# EAGLE design nixie_test_v3 (EAGLE 6.2)
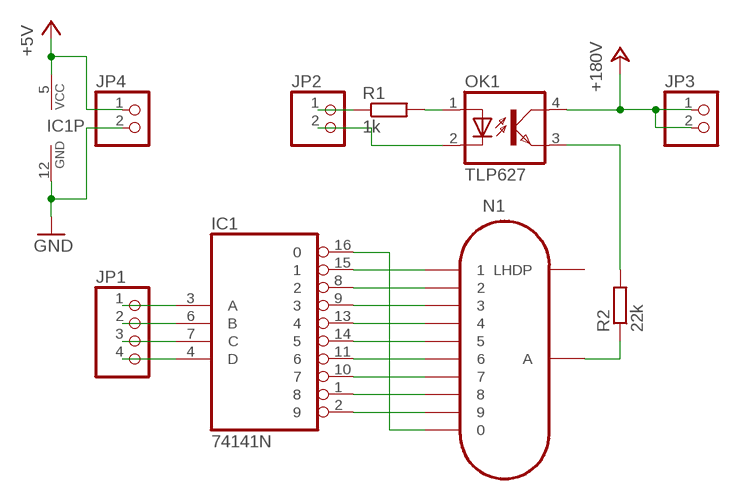
[diagram p0: schematic, sheet 1]

## Parts
IC1  74141N  [DIL16]
JP1  PINHD-1X4  [1X04]
JP2  PINHD-1X2  [1X02]
JP3  PINHD-1X2  [1X02]
JP4  PINHD-1X2  [1X02]
N1  IN-12B  [IN-12]
OK1  TLP627  [4-SMD]
R1  1k  R-EU_R0805  [R0805]
R2  22k  R-EU_10  [0207/10]

## Nets
+5V: IC1.5(VCC) JP4.1
+180V: JP3.1 JP3.2 OK1.4(COL)
A: IC1.3(A) JP1.1
B: IC1.6(B) JP1.2
C: IC1.7(C) JP1.3
C0: IC1.16 N1.0
C1: IC1.15 N1.1
C2: IC1.8 N1.2
C3: IC1.9 N1.3
C4: IC1.13 N1.4
C5: IC1.14 N1.5
C6: IC1.11 N1.6
C7: IC1.10 N1.7
C8: IC1.1 N1.8
C9: IC1.2 N1.9
D: IC1.4(D) JP1.4
GND: IC1.12(GND) JP4.2
LA: JP2.1 R1.1
LK: JP2.2 OK1.2(C)
N$17: N1.A R2.1
N$18: OK1.3(EMIT) R2.2
N$23: OK1.1(A) R1.2
Unconnected: N1.LHDP

## Library data of the parts
IC1 = nixie_tube:74*141: BCD to decimal DECODER/DRIVER
JP1 = nixie_tube:PINHD-1X4: PIN HEADER
JP2-JP4 = nixie_tube:PINHD-1X2: PIN HEADER
N1 = nixie_tube:IN-12B: IN-12B: medium numeric topview nixie tube
OK1 = nixie_tube:TLP627: TOSHIBA PHOTOCOUPLER GaAs IRED & PHOTO-TRANSISTOR Source: http://www.semicon.toshiba.co.jp/td/en/Opto/Photocoupler/en_20050928_TLP283_datasheet.pdf; OC_FARNELL: unknown; OC_NEWARK: unknown
R1 R2 = nixie_tube:R-EU_: RESISTOR, European symbol

## Board
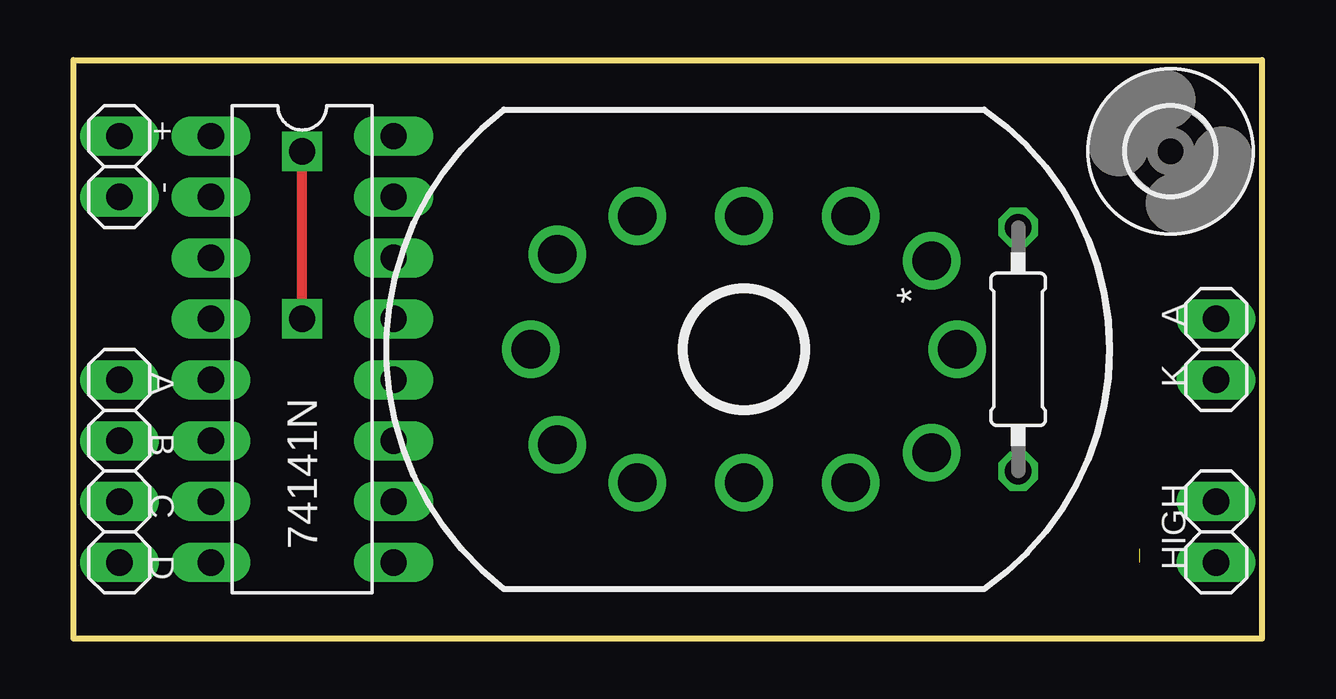
[diagram p1: board, top side]
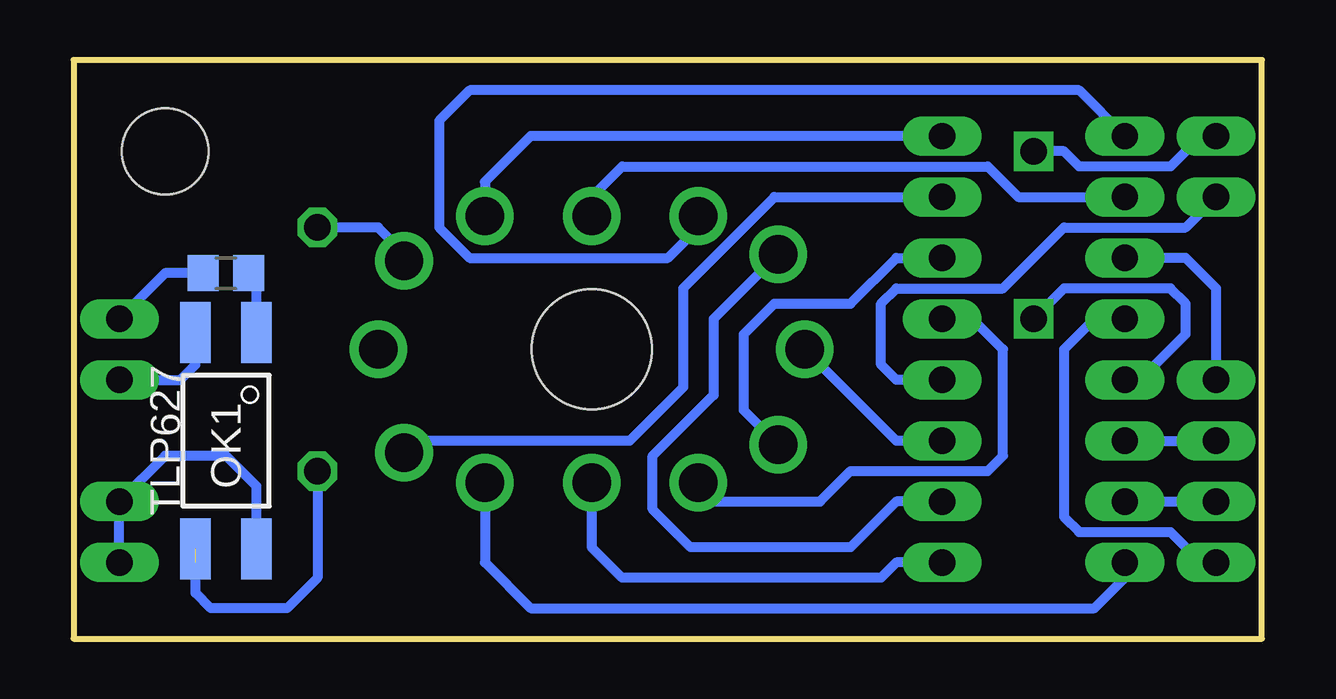
[diagram p2: board, bottom side, seen from below]

Size 49.53 x 24.13 mm. Coordinates in mm from the lower left corner, seen from the top.
Outline: 0,0 0,24.13 49.53,24.13 49.53,0 0,0
Copper layers (1*16): Top 0.035mm / dielectric 1.5mm / Bottom 0.035mm
Design rules: minimum track width 10mil, minimum drill 24mil, track to track 8mil, track to pad 8mil, pad to pad 8mil, via to via 8mil, smd to smd 8mil, copper to edge 40mil, drill to drill 8mil, minimum pad ring 10mil, minimum via ring 8mil, stop-mask expansion 4mil, vias tented up to drill 0mil, thermal gap 10mil

### Footprints (pad centres in the part's own frame; a part is rotated, then mirrored left to right if it is on the bottom)
DIL16 = drill 1.1 long: 1 -8.89,-3.81; 2 -6.35,-3.81; 3 -3.81,-3.81; 4 -1.27,-3.81; 5 1.27,-3.81; 6 3.81,-3.81; 7 6.35,-3.81; 8 8.89,-3.81; 9 8.89,3.81; 10 6.35,3.81; 11 3.81,3.81; 12 1.27,3.81; 13 -1.27,3.81; 14 -3.81,3.81; 15 -6.35,3.81; 16 -8.89,3.81
1X04 = drill 1.1 long: 1 -3.81,0; 2 -1.27,0; 3 1.27,0; 4 3.81,0
1X02 = drill 1.1 long: 1 -1.27,0; 2 1.27,0
IN-12 = drill 1.6: 0 5.556,-4.445; 1 -4.317,-7.817; 2 -5.556,-4.445; 3 -5.556,0; 4 -5.556,4.445; 5 -3.969,7.779; 6 0,8.89; 7 3.969,7.779; 8 5.556,4.445; 9 5.556,0; A 3.683,-7.817; LHDP 0,-8.89 | hole 5: 0,0
4-SMD = smd 2.54 x 1.27: 1 -4.51,1.27; 2 -4.51,-1.27; 3 4.51,-1.27; 4 4.51,1.27
R0805 = smd 1.3 x 1.5: 1 -0.95,0; 2 0.95,0
0207/10 = drill 1.1 octagon: 1 -5.08,0; 2 5.08,0
3,6 = hole 3.6: 0,0

### Placement (x,y rotation side)
IC1  9.53,12.06 270 top
JP1  1.91,6.99 270 top
JP2  47.62,12.06 270 top
JP3  47.62,4.45 90 top
JP4  1.91,19.68 270 top
N1  27.94,12.06 90 top
OK1  43.18,8.26 270 bottom
R1  43.18,15.24 0 bottom
R2  39.37,12.06 270 top
U$1  [3,6]  45.72,20.32 270 top

### Tracks (layer width: path | path; a pad name or v marks a point on that pad's centre or on a via)
+5V  (via drill 1.1)
  Top 0.406: v9.53,13.34 v9.53,20.32
  Bottom 0.406: IC1.5 5.08,10.79 3.17,12.7 3.17,13.97 3.81,14.61 8.26,14.61 v9.53,13.34 | JP4.1 2.54,20.95 3.81,19.68 7.62,19.68 8.26,20.32 v9.53,20.32
+180V
  Bottom 0.406: JP3.1 JP3.2 45.72,7.62 43.18,7.62 41.91,6.35 OK1.4
A
  Bottom 0.406: JP1.1 1.91,14.61 3.17,15.88 IC1.3
B
  Bottom 0.406: IC1.6 JP1.2
C
  Bottom 0.406: IC1.7 JP1.3
C0
  Bottom 0.406: N1.0 32.38,19.05 30.48,20.95 IC1.16
C1
  Bottom 0.406: IC1.15 20.32,18.41 24.13,14.61 24.13,10.48 26.35,8.26 35.24,8.26 N1.1 | N1.1 | N1.1 35.88,7.62
C2
  Bottom 0.406: N1.2 32.38,3.17 30.48,1.27 6.99,1.27 5.71,2.54 IC1.8
C3
  Bottom 0.406: IC1.9 15.24,3.17 15.88,2.54 26.67,2.54 27.94,3.81 N1.3
C4
  Bottom 0.406: IC1.13 12.06,13.34 10.79,12.06 10.79,7.62 11.43,6.99 17.14,6.99 18.41,5.71 22.86,5.71 23.5,6.35 N1.4
C5
  Bottom 0.406: N1.5 21.59,9.53 21.59,12.7 20.32,13.97 17.14,13.97 15.24,15.88 IC1.14
C6
  Bottom 0.406: IC1.11 15.24,8.26 N1.6
C7
  Bottom 0.406: IC1.10 15.24,5.71 17.14,3.81 23.81,3.81 25.4,5.4 25.4,7.62 22.86,10.16 22.86,13.34 N1.7
C8
  Bottom 0.406: IC1.1 7.62,22.86 33.02,22.86 34.29,21.59 34.29,17.14 33.02,15.88 24.77,15.88 23.5,17.14 N1.8
C9
  Bottom 0.406: IC1.2 10.16,18.41 11.43,19.68 26.67,19.68 27.94,18.41 N1.9
D
  Bottom 0.406: IC1.4 6.99,13.34 8.26,12.06 8.26,5.08 7.62,4.45 3.81,4.45 2.54,3.17 JP1.4
GND
  Bottom 0.406: IC1.12 15.24,10.79 15.88,11.43 15.88,13.97 15.24,14.61 10.79,14.61 8.26,17.14 3.17,17.14 JP4.2
LA
  Bottom 0.406: R1.1 45.72,15.24 JP2.1
LK
  Bottom 0.406: JP2.2 45.09,10.79 44.45,11.43 OK1.2
N$17
  Bottom 0.406: N1.A 35.76,16.07 36.83,17.14 R2.1
N$18  (1 unrouted)
  Bottom 0.406: R2.2 39.37,2.54 40.64,1.27 43.81,1.27 44.45,1.91 44.45,3.17
N$23
  Bottom 0.406: OK1.1 41.91,14.92 R1.2

### Text on the board
tNames: + | - | A | A | K | B | C | D | HIGH